# Altium schematic sheet 1_P2.schdoc
size 309 x 223 mm; Symbol: Sheet-Symbol_A4; Device: Sheet-Symbol_A4; @Page Name: P2; @Create Date: 2024-05-10; @Page Count: 2; @Page No: 2; @Project Name: ESP32_lvgl; @Schematic Name: Schematic1; @Update Date: 2024-05-22; Company: 嘉立创EDA; Page Size: A4; Version: V1.0
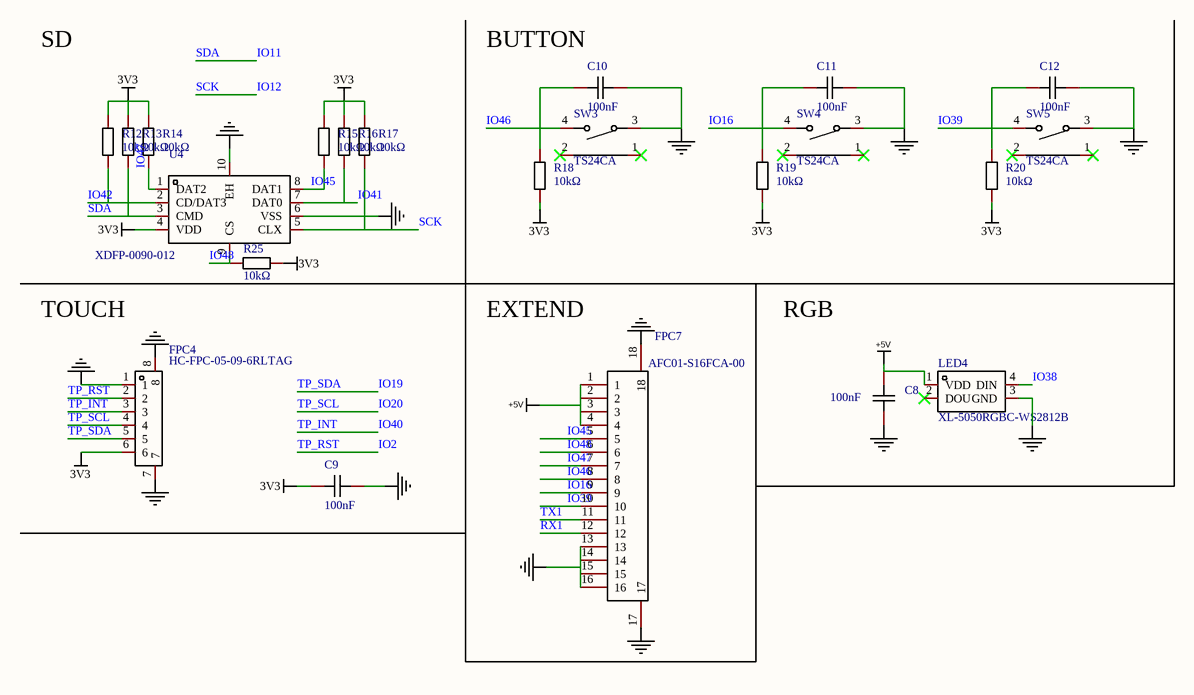
[diagram p0: 1_P2.schdoc]

## Parts
C8  100nF  [C0603]
C9  100nF  [C0603]
C10  100nF  [C0603]
C11  100nF  [C0603]
C12  100nF  [C0603]
FPC4  HC-FPC-05-09-6RLTAG  [FPC-SMD_6P-P0.50_HC-FPC-05-09-6RLTAG]
FPC7  AFC01-S16FCA-00  [FPC-SMD_P0.50-16P_FGS-XJ-H2.0]
LED4  XL-5050RGBC-WS2812B  [LED-SMD_4P-L5.0-W5.0-BL_XL-5050RGBC]
R12  10kΩ  [R0603]
R13  10kΩ  [R0603]
R14  10kΩ  [R0603]
R15  10kΩ  [R0603]
R16  10kΩ  [R0603]
R17  10kΩ  [R0603]
R18  10kΩ  [R0603]
R19  10kΩ  [R0603]
R20  10kΩ  [R0603]
R25  10kΩ  [R0603]
SW3  TS24CA  [SW-SMD_TS24CA]
SW4  TS24CA  [SW-SMD_TS24CA]
SW5  TS24CA  [SW-SMD_TS24CA]
U4  XDFP-0090-012  [SIM-SMD_LX_XDFP-0090-012]

## Nets
3V3: C9.2 FPC4.6 R12.2 R13.2 R14.2 R15.2 R16.2 R17.2 R18.1 R19.1 R20.1 R25.1 U4.4(VDD)
+5V: C8.2 FPC7.1 FPC7.2 FPC7.3 FPC7.4 LED4.1(VDD)
NetC8_1: C8.1 C9.1 C10.2 C11.2 C12.2 FPC4.1 FPC4.7 FPC4.8 FPC7.13 FPC7.14 FPC7.15 FPC7.16 FPC7.17 FPC7.18 LED4.3(GND) SW3.3 SW4.3 SW5.3 U4.6(VSS) U4.10(EH)
IO2: FPC4.2  [also labelled TP_RST]
IO11: R13.1 U4.3(CMD)  [also labelled SDA]
IO12: R17.1 U4.5(CLX)  [also labelled SCK]
IO16: C11.1 FPC7.9 R19.2 SW4.4
IO19: FPC4.5  [also labelled TP_SDA]
IO20: FPC4.4  [also labelled TP_SCL]
IO38: LED4.4(DIN)
IO39: C12.1 FPC7.10 R20.2 SW5.4
IO40: FPC4.3  [also labelled TP_INT]
IO41: R16.1 U4.7(DAT0)
IO42: R12.1 U4.2(CD/DAT3)
IO45: FPC7.5 R15.1 U4.8(DAT1)
IO46: C10.1 FPC7.8 R18.2 SW3.4
IO47: FPC7.7 R14.1 U4.1(DAT2)
IO48: FPC7.6 R25.2 U4.9(CS)
RX1: FPC7.12
TX1: FPC7.11

Not connected (* = marked no-connect by the designer): LED4 2(DOU)*; SW3 1* 2*; SW4 1* 2*; SW5 1* 2*

## Notes on the sheet
- SD
- (near C10) BUTTON
- TOUCH
- EXTEND
- RGB
- 1
- 2
- 3
- 4
- 5
- 6
- A
- B
- C
- 原理图
- Schematic1
- 创建日期
- 更新日期
- 2024-05-10
- 2024-05-22
- 审阅
- 绘制
- 图页
- P2
- 物料编码
- ESP32_lvgl
- D
- 版本
- 尺寸
- 页
- 共
- V1.0
- A4
- 嘉立创EDA

## Library data of the parts
C8-C12 = CC0603KRX7R9BB104: 容值:100nF;精度:±10%;额定电压:50V;材质(温度系数):X7R;; Manufacturer: YAGEO(国巨); Add into BOM: yes; Tolerance: ±10%; Voltage Rated: 50V; Temperature Coefficient: X7R; Name: 100nF; Symbol: CC0603KRX7R9BB104; Device: CC0603KRX7R9BB104; LCSC Part Name: 100nF ±10% 50V; Supplier Part: C14663; Manufacturer Part: CC0603KRX7R9BB104; Supplier Footprint: 0603; JLCPCB Part Class: 基础库; Datasheet: https://atta.szlcsc.com/upload/public/pdf/source/20180910/C282072_33301C7F631E79921B82A8DAC6BCC5B3.pdf; Supplier: LCSC; Convert to PCB: yes; Value: 100nF
FPC4 = HC-FPC-05-09-6RLTAG: 锁定特性:翻盖式;触点类型:双侧触点/上下接;触点数量:6P;间距:0.5mm;安装类型:卧贴;工作温度范围:-55℃~+85℃;; Manufacturer: HCTL(华灿天禄); Add into BOM: yes; Locking Feature: 翻盖式; Number of Contacts: 6P; Pitch: 0.5mm; FFC, FCB Thickness: 0.3mm; Name: HC-FPC-05-09-6RLTAG; Symbol: HC-FPC-05-09-6RLTAG; Device: HC-FPC-05-09-6RLTAG; LCSC Part Name: 翻盖式 双侧触点/上下接 P数:6P 间距:0.5mm; Supplier Part: C5213748; Manufacturer Part: HC-FPC-05-09-6RLTAG; Supplier Footprint: SMD,P=0.5mm,卧贴; JLCPCB Part Class: 扩展库; Datasheet: https://atta.szlcsc.com/upload/public/pdf/source/20221026/52A26161A88FCE07A06989F8D4399614.pdf; Supplier: LCSC; Convert to PCB: yes; Contact Type: 双侧触点/上下接; Mounting Type: 卧贴; Height Above Board: 1mm; Contact Material: 铜合金; Operating Temperature Range: -55℃~+85℃
FPC7 = AFC01-S16FCA-00: 锁定特性:翻盖式;触点类型:下接;触点数量:16P;间距:0.5mm;安装类型:卧贴;; Manufacturer: JS(钜硕电子); Add into BOM: yes; Locking Feature: 翻盖式; Number of Contacts: 16P; Pitch: 0.5mm; FFC, FCB Thickness: 0.3mm; Name: AFC01-S16FCA-00; Symbol: AFC01-S16FCA-00; Device: AFC01-S16FCA-00; LCSC Part Name: 间距:0.5mm P数:16P 翻盖式 下接; Supplier Part: C262665; Manufacturer Part: AFC01-S16FCA-00; Supplier Footprint: SMD,P=0.5mm,卧贴; JLCPCB Part Class: 扩展库; Datasheet: https://atta.szlcsc.com/upload/public/pdf/source/20190816/C413942_2A72D1AC756EAE17EEDF756A339D4500.pdf; Supplier: LCSC; Convert to PCB: yes; Contact Type: 下接; Mounting Type: 卧贴; Height Above Board: 2mm
LED4 = XL-5050RGBC-WS2812B: 5050七彩幻彩透明贴片LED灯珠 5050 幻彩透明四脚 ws2812B 内置驱动IC; Manufacturer: XINGLIGHT(成兴光); Add into BOM: yes; Name: XL-5050RGBC-WS2812B; Symbol: XL-5050RGBC-WS2812B; Device: XL-5050RGBC-WS2812B; LCSC Part Name: XL-5050RGBC-WS2812B; Supplier Part: C2843785; Manufacturer Part: XL-5050RGBC-WS2812B; Supplier Footprint: SMD5050; JLCPCB Part Class: 扩展库; Datasheet: https://atta.szlcsc.com/upload/public/pdf/source/20240412/E1004CAA80592E31D08BFE019083806F.pdf; Supplier: LCSC; Convert to PCB: yes
R12-R20 R25 = 0603WAF1002T5E: 电阻类型:厚膜电阻;阻值:10kΩ;精度:±1%;功率:100mW;最大工作电压:75V;温度系数:±100ppm/℃;; Manufacturer: UNI-ROYAL(厚声); Add into BOM: yes; Tolerance: ±1%; Power(Watts): 100mW; Overload Voltage (Max): 75V; Name: 10kΩ; Symbol: 0603WAF1002T5E; Device: 0603WAF1002T5E; LCSC Part Name: 厚膜电阻 10kΩ ±1% 100mW; Supplier Part: C25804; Manufacturer Part: 0603WAF1002T5E; Supplier Footprint: 0603; JLCPCB Part Class: 基础库; Datasheet: https://atta.szlcsc.com/upload/public/pdf/source/20200306/C422600_1E6D84923E4A46A82E41ADD87F860B5C.pdf; Supplier: LCSC; Convert to PCB: yes; Type: 厚膜电阻; Value: 10kΩ; Temperature Coefficient: ±100ppm/℃; Operating Temperature Range: -55℃~+155℃
SW3-SW5 = TS24CA: 电路结构:单刀单掷;按钮形状:矩形按钮;安装方式:卧贴;开关长度:4.55mm;开关宽度:1.8mm;开关高度:3.5mm;触点电流:50mA;额定电压(DC):12V;带灯:-;机械寿命:-;; Manufacturer: SHOU HAN(首韩); Add into BOM: yes; Circuit: 单刀单掷; Actuator Style: 矩形按钮; Switch Length: 4.55mm; Switch Width: 1.8mm; Switch Height: 3.5mm; Contact Current: 50mA; Voltage Rating (DC): 12V; Name: TS24CA; Symbol: TS24CA; Device: TS24CA; LCSC Part Name: 4.55*1.8*3.5mm 卧贴 轻触开关; Supplier Part: C393942; Manufacturer Part: TS24CA; Supplier Footprint: SMD; JLCPCB Part Class: 扩展库; Datasheet: https://atta.szlcsc.com/upload/public/pdf/source/20190521/C393942_591A9E318887EFA4274D34029981AD99.pdf; Supplier: LCSC; Convert to PCB: yes; Mounting Style: 卧贴; With Lamp: -; Mechanical Life: -
U4 = XDFP-0090-012: 卡连接方式:自弹式;本体最大高度:1.85mm;触头镀层:金;; Manufacturer: LX(连欣科技); Add into BOM: yes; Card Connection Mode: 自弹式; Body Height (Max): 1.85mm; Name: XDFP-0090-012; Symbol: XDFP-0090-012; Device: XDFP-0090-012; LCSC Part Name: 自弹式外焊 Micro SD卡座/TF卡座9PIN; Supplier Part: C7498122; Manufacturer Part: XDFP-0090-012; Supplier Footprint: SMD; JLCPCB Part Class: 扩展库; Datasheet: https://atta.szlcsc.com/upload/public/pdf/source/20230919/3284334F72F9F9D639C35504FE7D1962.pdf; Supplier: LCSC; Convert to PCB: yes; Contact Plating: 金